# Altium schematic sheet Tead_Aliens_64A_ESP.SchDoc: Tead Aliens 64A ESP8266
size A4; Date: 27/01/2021; ApprovedBy: NeperMath; CheckedBy: NeperMath; Author: NeperMath; DrawnBy: NeperMath; Engineer: NeperMath; DocumentNumber: 1; Revision: 1; SheetNumber: 1; SheetTotal: 1; CurrentTime: 19:35; CurrentDate: 27/01/2021; Time: 19:34
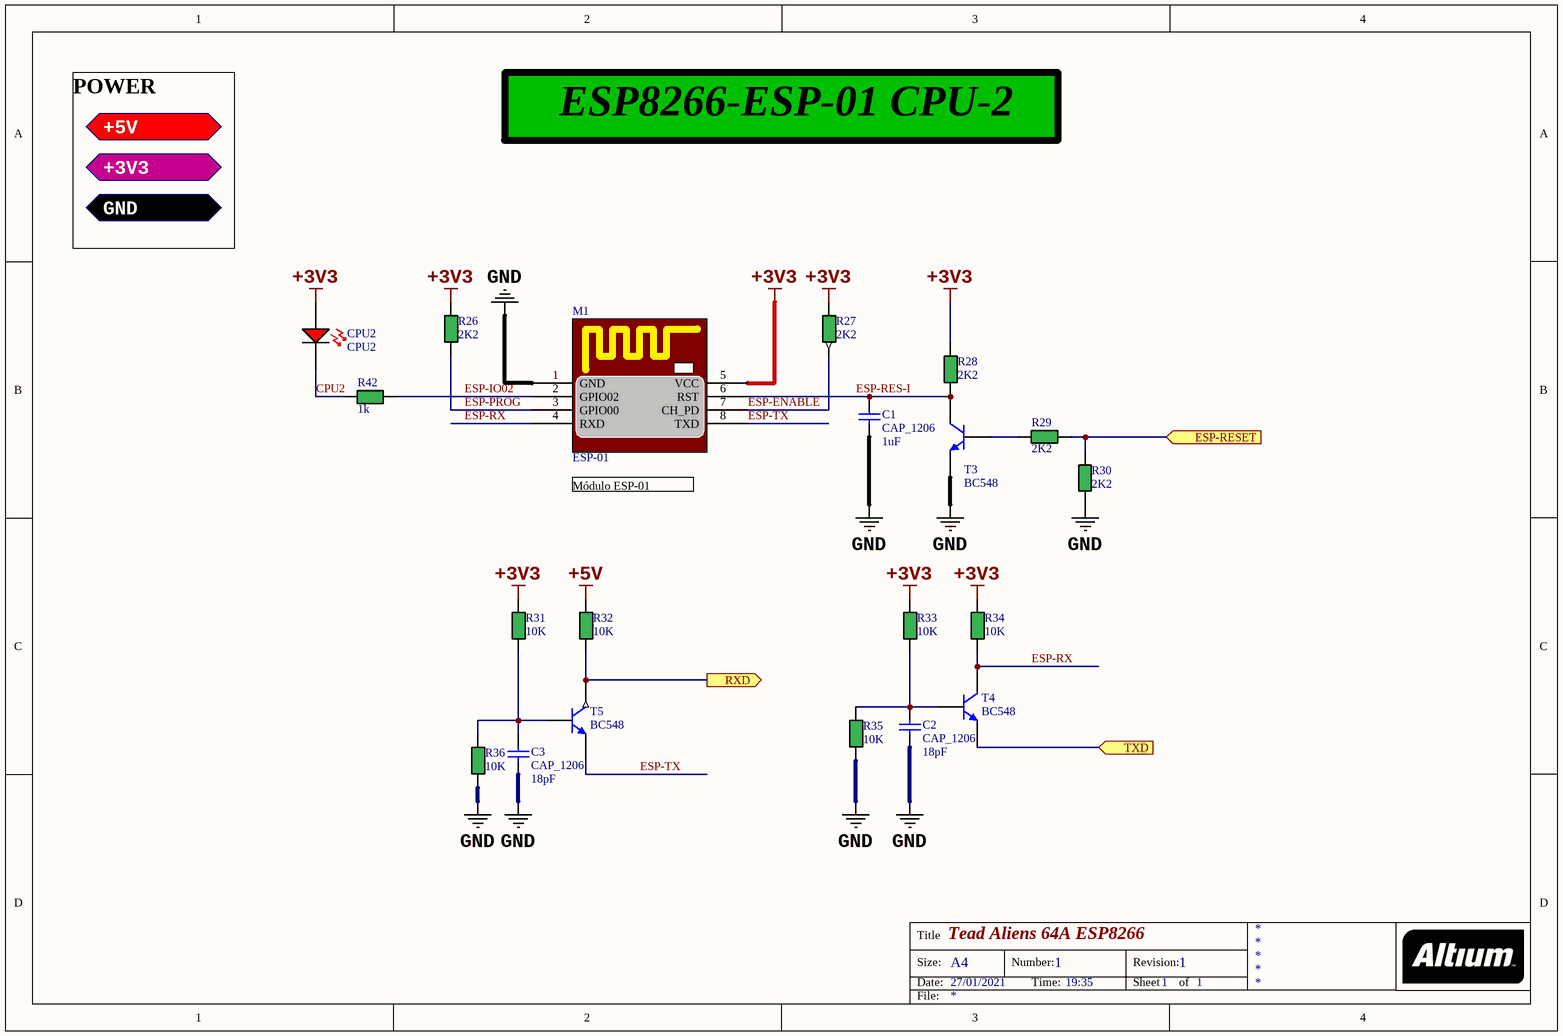
[diagram p0: Tead_Aliens_64A_ESP.SchDoc]

## Parts
C1  CAP_1206  value 1uF  [CAP_1206]
C2  CAP_1206  value 18pF  [CAP_1206]
C3  CAP_1206  value 18pF  [CAP_1206]
CPU2  CPU2  [LED Red 3mm]
M1  ESP-01  [ESP-8266-ESP-01]
R26  value 2K2  [RES_0805]  (hidden comment: Resistor Generic)
R27  value 2K2  [RES_0805]  (hidden comment: Resistor Generic)
R28  value 2K2  [RES_0805]  (hidden comment: Resistor Generic)
R29  value 2K2  [RES_0805]  (hidden comment: Resistor Generic)
R30  value 2K2  [RES_0805]  (hidden comment: Resistor Generic)
R31  value 10K  [RES_0805]  (hidden comment: Resistor Generic)
R32  value 10K  [RES_0805]  (hidden comment: Resistor Generic)
R33  value 10K  [RES_0805]  (hidden comment: Resistor Generic)
R34  value 10K  [RES_0805]  (hidden comment: Resistor Generic)
R35  value 10K  [RES_0805]  (hidden comment: Resistor Generic)
R36  value 10K  [RES_0805]  (hidden comment: Resistor Generic)
R42  value 1k  [RES_0805]  (hidden comment: Resistor Generic)
T3  value BC548  [TO-92 - BIG]  (hidden comment: Transistor)
T4  value BC548  [TO-92 - BIG]  (hidden comment: Transistor)
T5  value BC548  [TO-92 - BIG]  (hidden comment: Transistor)

## Ports
+3V3, +5V, ESP-RESET (in), GND, RXD (out), TXD (in)

## Nets
+3V3: CPU2.A M1.5(VCC) R26.2 R27.2 R28.2 R31.2 R33.2 R34.2
+5V: R32.2
GND: C1.1 C2.1 C3.1 M1.1(GND) R30.2 R35.1 R36.1 T3.1(E)
CPU2: CPU2.K R42.1
ESP-ENABLE: M1.7(CH_PD) R27.1
ESP-IO02: M1.2(GPIO02) R42.2
ESP-PROG: M1.3(GPIO00) R26.1
ESP-RES-I: C1.2 M1.6(RST) R28.1 T3.3(C)
ESP-RESET: R29.1 R30.1 ; port ESP-RESET
ESP-RX: M1.4(RXD) R34.1 T4.3(C)
ESP-TX: M1.8(TXD) T5.1(E)
RXD: R32.1 T5.3(C) ; port RXD
TXD: T4.1(E) ; port TXD
NetC2_2: C2.2 R33.1 R35.2 T4.2(B)
NetC3_2: C3.2 R31.1 R36.2 T5.2(B)
NetR29_2: R29.2 T3.2(B)

## Notes on the sheet
- ESP8266-ESP-01 CPU-2
- POWER
- Módulo ESP-01
- Title
- Size:
- Date:
- A4
- Number:
- Time:
- Revision:
- Sheet
- of
- File:

## Library data of the parts
C1-C3 = CAP_1206: SMD Capacitor 1206 size
CPU2 = LED-RED: LED RED
M1 = ESP-01 Module: ESP8266 ESP-01 Module
R26-R36 R42 = Resistor Generic: Generic Resistor
T3-T5 = T-NPN: General Bipolar Transistor NPN